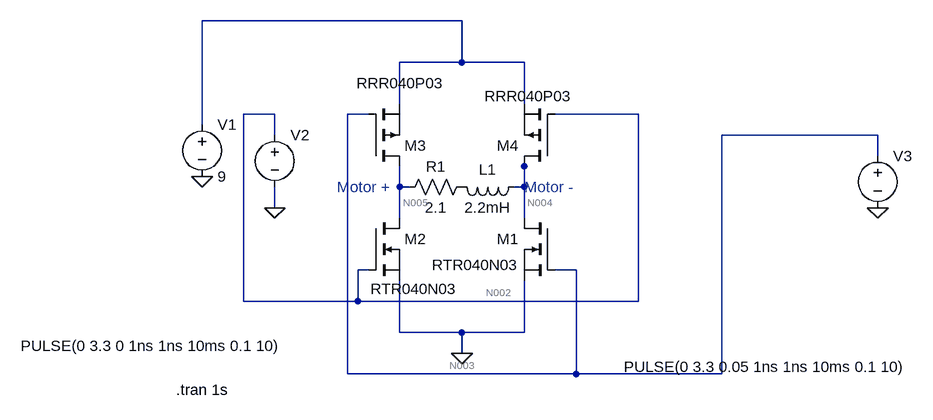
[diagram p0: schematic HBrdige.asc]
HBrdige.asc, the LTspice schematic file:
Version 4.1
SHEET 1 1220 680
WIRE 512 -64 112 -64
WIRE 512 0 512 -64
WIRE 512 0 416 0
WIRE 608 0 512 0
WIRE 416 64 416 0
WIRE 608 64 608 0
WIRE 224 80 176 80
WIRE 368 80 336 80
WIRE 784 80 656 80
WIRE 112 96 112 -64
WIRE 224 112 224 80
WIRE 1152 112 912 112
WIRE 1152 144 1152 112
WIRE 608 160 608 144
WIRE 416 192 416 160
WIRE 432 192 416 192
WIRE 608 192 608 160
WIRE 608 192 592 192
WIRE 224 224 224 192
WIRE 416 240 416 192
WIRE 608 240 608 192
WIRE 368 320 352 320
WIRE 688 320 656 320
WIRE 176 368 176 80
WIRE 352 368 352 320
WIRE 352 368 176 368
WIRE 784 368 784 80
WIRE 784 368 352 368
WIRE 416 416 416 336
WIRE 512 416 416 416
WIRE 608 416 608 336
WIRE 608 416 512 416
WIRE 512 448 512 416
WIRE 336 480 336 80
WIRE 688 480 688 320
WIRE 688 480 336 480
WIRE 912 480 912 112
WIRE 912 480 688 480
FLAG 112 176 0
FLAG 512 448 0
FLAG 224 224 0
FLAG 1152 224 0
SYMBOL voltage 112 80 R0
WINDOW 123 0 0 Left 0
WINDOW 39 0 0 Left 0
SYMATTR InstName V1
SYMATTR Value 9
SYMBOL ind 608 176 R90
WINDOW 0 5 56 VBottom 2
WINDOW 3 32 56 VTop 2
SYMATTR InstName L1
SYMATTR Value 2.2mH
SYMBOL res 528 176 R90
WINDOW 0 0 56 VBottom 2
WINDOW 3 32 56 VTop 2
SYMATTR InstName R1
SYMATTR Value 2.1
SYMBOL voltage 224 96 R0
WINDOW 123 0 0 Left 0
WINDOW 39 0 0 Left 0
WINDOW 3 -391 341 Left 2
SYMATTR Value PULSE(0 3.3 0 1ns 1ns 10ms 0.1 10)
SYMATTR InstName V2
SYMBOL nmos 656 240 M0
SYMATTR InstName M1
SYMATTR Value RTR040N03
SYMBOL nmos 368 240 R0
WINDOW 3 3 109 Left 2
SYMATTR InstName M2
SYMATTR Value RTR040N03
SYMBOL pmos 368 160 M180
WINDOW 3 -18 128 Left 2
SYMATTR InstName M3
SYMATTR Value RRR040P03
SYMBOL pmos 656 160 R180
WINDOW 3 -26 108 Left 2
SYMATTR InstName M4
SYMATTR Value RRR040P03
SYMBOL voltage 1152 128 R0
WINDOW 123 0 0 Left 0
WINDOW 39 0 0 Left 0
WINDOW 3 -391 341 Left 2
SYMATTR Value PULSE(0 3.3 0.05 1ns 1ns 10ms 0.1 10)
SYMATTR InstName V3
TEXT 72 504 Left 2 !.tran 1s
TEXT 320 192 Left 2 ;Motor +
TEXT 608 192 Left 2 ;Motor -

The netlist it stands for:
* HBrdige.asc
V1 N001 0 9
L1 N004 P001 2.2mH
R1 P001 N005 2.1
V2 N002 0 PULSE(0 3.3 0 1ns 1ns 10ms 0.1 10)
M1 N004 N003 0 0 RTR040N03
M2 N005 N002 0 0 RTR040N03
M3 N005 N003 N001 N001 RRR040P03
M4 N004 N002 N001 N001 RRR040P03
V3 N003 0 PULSE(0 3.3 0.05 1ns 1ns 10ms 0.1 10)
.model NMOS NMOS
.model PMOS PMOS
.lib standard.mos
.tran 1s
* Motor +
* Motor -
.backanno
.end

* Results of the author's LTspice run, read from the files saved beside the schematic
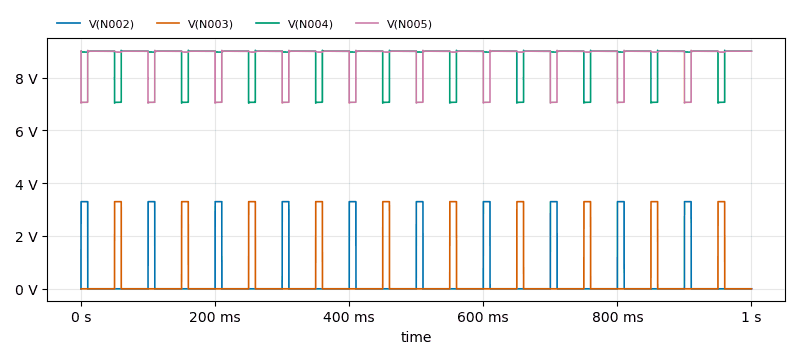
[diagram p1: Transient Analysis of HBrdige.asc, plotted from the saved traces]
* Transient Analysis, 1 run:
*   V(N002): min 0 V, max 3.3 V, average 330 mV, rms 1.044 V, last 0 V
*   V(N003): min 0 V, max 3.3 V, average 330 mV, rms 1.044 V, last 0 V
*   V(N004): min 7.034 V, max 9.03 V, average 8.803 V, rms 8.822 V, last 9 V
*   V(N005): min 7.034 V, max 9.03 V, average 8.803 V, rms 8.822 V, last 9 V